# EAGLE design Tetris (EAGLE 6.5.0)
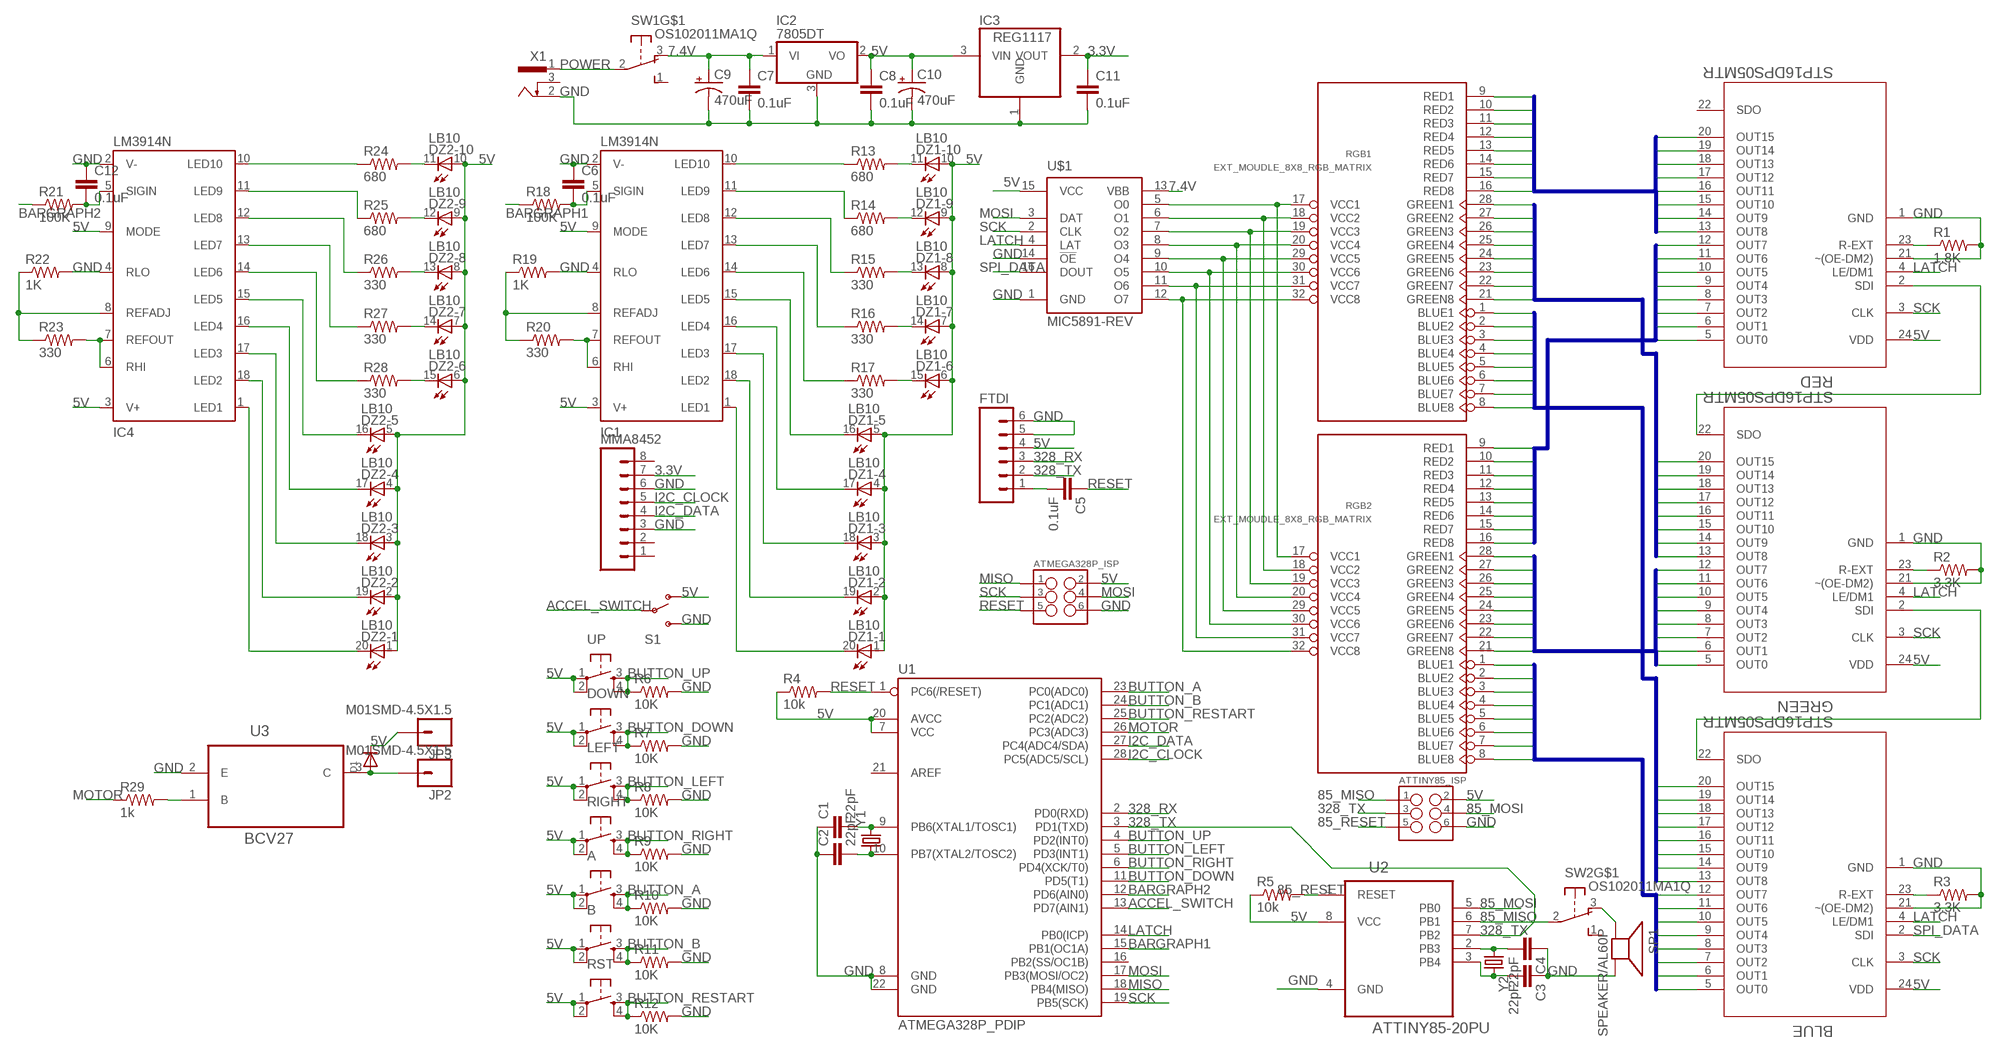
[diagram p0: schematic, sheet 1]

## Parts
A  TAC_SWITCHPTH  [TACTILE-PTH]
ATMEGA328P_ISP  M03X22X3_SILK_SM  [2X3]
ATTINY85_ISP  M03X22X3_SILK_SM  [2X3]
B  TAC_SWITCHPTH  [TACTILE-PTH]
BLUE  STP16DPS05MTR  [SOIC127P1032X265-24N]
C1  22pF  CAP0805  [0805]
C2  22pF  CAP0805  [0805]
C3  22pF  CAP0805  [0805]
C4  22pF  CAP0805  [0805]
C5  0.1uF  CAP0805  [0805]
C6  0.1uF  CAP0805  [0805]
C7  0.1uF  CAP0805  [0805]
C8  0.1uF  CAP0805  [0805]
C9  470uF  CAP_POLD  [PANASONIC_D]
C10  470uF  CAP_POLD  [PANASONIC_D]
C11  0.1uF  CAP0805  [0805]
C12  0.1uF  CAP0805  [0805]
D1  DIODESMA  [SMADIODE]
DOWN  TAC_SWITCHPTH  [TACTILE-PTH]
DZ1  LB10  [LB10]
DZ2  LB10  [LB10]
FTDI  M06LOCK  [1X06_LOCK]
GREEN  STP16DPS05MTR  [SOIC127P1032X265-24N]
IC1  LM3914N  [DIL18]
IC2  7805DT  [TO252]
IC3  REG1117  [SOT223]
IC4  LM3914N  [DIL18]
JP2  M01SMD-4.5X1.5  [PAD-1.5X4.5]
JP3  M01SMD-4.5X1.5  [PAD-1.5X4.5]
LEFT  TAC_SWITCHPTH  [TACTILE-PTH]
MMA8452  M08LOCK  [1X08_LOCK]
R1  1.8K  RESISTOR0805-RES  [0805]
R2  3.3K  RESISTOR0805-RES  [0805]
R3  3.3K  RESISTOR0805-RES  [0805]
R4  10k  RESISTOR0805-RES  [0805]
R5  10k  RESISTOR0805-RES  [0805]
R6  10K  RESISTOR0805-RES  [0805]
R7  10K  RESISTOR0805-RES  [0805]
R8  10K  RESISTOR0805-RES  [0805]
R9  10K  RESISTOR0805-RES  [0805]
R10  10K  RESISTOR0805-RES  [0805]
R11  10K  RESISTOR0805-RES  [0805]
R12  10K  RESISTOR0805-RES  [0805]
R13  680  RESISTOR0805-RES  [0805]
R14  680  RESISTOR0805-RES  [0805]
R15  330  RESISTOR0805-RES  [0805]
R16  330  RESISTOR0805-RES  [0805]
R17  330  RESISTOR0805-RES  [0805]
R18  100K  RESISTOR0805-RES  [0805]
R19  1K  RESISTOR0805-RES  [0805]
R20  330  RESISTOR0805-RES  [0805]
R21  100K  RESISTOR0805-RES  [0805]
R22  1K  RESISTOR0805-RES  [0805]
R23  330  RESISTOR0805-RES  [0805]
R24  680  RESISTOR0805-RES  [0805]
R25  680  RESISTOR0805-RES  [0805]
R26  330  RESISTOR0805-RES  [0805]
R27  330  RESISTOR0805-RES  [0805]
R28  330  RESISTOR0805-RES  [0805]
R29  1k  RESISTOR0805-RES  [0805]
RED  STP16DPS05MTR  [SOIC127P1032X265-24N]
RGB1  EXT_MOUDLE_8X8_RGB_MATRIX  [EXT_MOUDLE_8X8_RGB_MATRIX]
RGB2  EXT_MOUDLE_8X8_RGB_MATRIX  [EXT_MOUDLE_8X8_RGB_MATRIX]
RIGHT  TAC_SWITCHPTH  [TACTILE-PTH]
RST  TAC_SWITCHPTH  [TACTILE-PTH]
S1  SWITCH-SPDTPTH_LOCK  [SWITCH-SPDT_LOCK.007S]
SP1  SPEAKER/AL60P  [AL60P]
SW1  OS102011MA1Q  [OS102011MA1Q]
SW2  OS102011MA1Q  [OS102011MA1Q]
U1  ATMEGA328P_PDIP  [DIL28-3]
U2  ATTINY85-20PU  [DIP254P762X533-8]
U3  BCV27  [SOT95P230X93-3N]
U$1  MIC5891-REV  [DIL16]
UP  TAC_SWITCHPTH  [TACTILE-PTH]
X1  733989-5  [733989-5]
Y1  CRYSTALHC49US  [HC49US]
Y2  CRYSTALHC49US  [HC49US]

## Nets
3.3V: C11.1 IC3.2(VOUT) MMA8452.7
5V: A.1 A.2 ATMEGA328P_ISP.2 ATTINY85_ISP.2 B.1 B.2 BLUE.24(VDD) C8.1 C10.+ D1.C DOWN.1 DOWN.2 DZ1.1(-1:A) DZ1.2(-2:A) DZ1.3(-3:A) DZ1.4(-4:A) DZ1.5(-5:A) DZ1.6(-6:A) DZ1.7(-7:A) DZ1.8(-8:A) DZ1.9(-9:A) DZ1.10(-10:A) DZ2.1(-1:A) DZ2.2(-2:A) DZ2.3(-3:A) DZ2.4(-4:A) DZ2.5(-5:A) DZ2.6(-6:A) DZ2.7(-7:A) DZ2.8(-8:A) DZ2.9(-9:A) DZ2.10(-10:A) FTDI.4 GREEN.24(VDD) IC1.3(V+) IC1.9(MODE) IC2.2(VO) IC3.3(VIN) IC4.3(V+) IC4.9(MODE) JP3.P$1 LEFT.1 LEFT.2 R4.1 R5.1 RED.24(VDD) RIGHT.1 RIGHT.2 RST.1 RST.2 S1.1(O) U1.7(VCC) U1.20(AVCC) U2.8(VCC) U$1.15(VCC) UP.1 UP.2
7.4V: C7.1 C9.+ IC2.1(VI) SW1.3(O) U$1.13(VBB)
85_MISO: ATTINY85_ISP.1 SW2.2(P) U2.6(PB1)
85_MOSI: ATTINY85_ISP.4 U2.5(PB0)
85_RESET: ATTINY85_ISP.5 R5.2 U2.1(RESET)
328_RX: FTDI.3 U1.2(PD0(RXD))
328_TX: ATTINY85_ISP.3 FTDI.2 U1.3(PD1(TXD)) U2.7(PB2)
ACCEL_SWITCH: S1.2(P) U1.13(PD7(AIN1))
BARGRAPH1: R18.1 U1.15(PB1(OC1A))
BARGRAPH2: R21.1 U1.12(PD6(AIN0))
BLUE1: BLUE.20(OUT15) RGB1.8(BLUE8)
BLUE2: BLUE.19(OUT14) RGB1.7(BLUE7)
BLUE3: BLUE.18(OUT13) RGB1.6(BLUE6)
BLUE4: BLUE.17(OUT12) RGB1.5(BLUE5)
BLUE5: BLUE.16(OUT11) RGB1.4(BLUE4)
BLUE6: BLUE.15(OUT10) RGB1.3(BLUE3)
BLUE7: BLUE.14(OUT9) RGB1.2(BLUE2)
BLUE8: BLUE.13(OUT8) RGB1.1(BLUE1)
BLUE9: BLUE.12(OUT7) RGB2.8(BLUE8)
BLUE10: BLUE.11(OUT6) RGB2.7(BLUE7)
BLUE11: BLUE.10(OUT5) RGB2.6(BLUE6)
BLUE12: BLUE.9(OUT4) RGB2.5(BLUE5)
BLUE13: BLUE.8(OUT3) RGB2.4(BLUE4)
BLUE14: BLUE.7(OUT2) RGB2.3(BLUE3)
BLUE15: BLUE.6(OUT1) RGB2.2(BLUE2)
BLUE16: BLUE.5(OUT0) RGB2.1(BLUE1)
BUTTON_A: A.3 A.4 R10.1 U1.23(PC0(ADC0))
BUTTON_B: B.3 B.4 R11.1 U1.24(PC1(ADC1))
BUTTON_DOWN: DOWN.3 DOWN.4 R7.1 U1.11(PD5(T1))
BUTTON_LEFT: LEFT.3 LEFT.4 R8.1 U1.5(PD3(INT1))
BUTTON_RESTART: R12.1 RST.3 RST.4 U1.25(PC2(ADC2))
BUTTON_RIGHT: R9.1 RIGHT.3 RIGHT.4 U1.6(PD4(XCK/T0))
BUTTON_UP: R6.1 U1.4(PD2(INT0)) UP.3 UP.4
GND: ATMEGA328P_ISP.6 ATTINY85_ISP.6 BLUE.1(GND) BLUE.21(~(OE-DM2)) C1.1 C2.1 C3.1 C4.1 C6.1 C7.2 C8.2 C9.- C10.- C11.2 C12.1 FTDI.5 FTDI.6 GREEN.1(GND) GREEN.21(~(OE-DM2)) IC1.2(V-) IC1.4(RLO) IC2.3(GND) IC3.1(GND) IC4.2(V-) IC4.4(RLO) MMA8452.3 MMA8452.6 R1.2 R2.2 R3.2 R6.2 R7.2 R8.2 R9.2 R10.2 R11.2 R12.2 R19.2 R22.2 RED.1(GND) RED.21(~(OE-DM2)) S1.3(S) SP1.2(-) U1.8(GND) U1.22(GND) U2.4(GND) U3.2(E) U$1.1(GND) U$1.14(!OE) X1.2
GREEN1: GREEN.20(OUT15) RGB1.21(GREEN8)
GREEN2: GREEN.19(OUT14) RGB1.22(GREEN7)
GREEN3: GREEN.18(OUT13) RGB1.23(GREEN6)
GREEN4: GREEN.17(OUT12) RGB1.24(GREEN5)
GREEN5: GREEN.16(OUT11) RGB1.25(GREEN4)
GREEN6: GREEN.15(OUT10) RGB1.26(GREEN3)
GREEN7: GREEN.14(OUT9) RGB1.27(GREEN2)
GREEN8: GREEN.13(OUT8) RGB1.28(GREEN1)
GREEN9: GREEN.12(OUT7) RGB2.21(GREEN8)
GREEN10: GREEN.11(OUT6) RGB2.22(GREEN7)
GREEN11: GREEN.10(OUT5) RGB2.23(GREEN6)
GREEN12: GREEN.9(OUT4) RGB2.24(GREEN5)
GREEN13: GREEN.8(OUT3) RGB2.25(GREEN4)
GREEN14: GREEN.7(OUT2) RGB2.26(GREEN3)
GREEN15: GREEN.6(OUT1) RGB2.27(GREEN2)
GREEN16: GREEN.5(OUT0) RGB2.28(GREEN1)
I2C_CLOCK: MMA8452.5 U1.28(PC5(ADC5/SCL))
I2C_DATA: MMA8452.4 U1.27(PC4(ADC4/SDA))
LATCH: BLUE.4(LE/DM1) GREEN.4(LE/DM1) RED.4(LE/DM1) U1.14(PB0(ICP)) U$1.4(LAT)
MISO: ATMEGA328P_ISP.1 U1.18(PB4(MISO))
MOSI: ATMEGA328P_ISP.4 U1.17(PB3(MOSI/OC2)) U$1.3(DAT)
MOTOR: R29.1 U1.26(PC3(ADC3))
N$1: R1.1 RED.23(R-EXT)
N$2: RGB1.18(VCC2) RGB2.18(VCC2) U$1.6(O1)
N$3: RGB1.19(VCC3) RGB2.19(VCC3) U$1.7(O2)
N$4: RGB1.20(VCC4) RGB2.20(VCC4) U$1.8(O3)
N$5: RGB1.29(VCC5) RGB2.29(VCC5) U$1.9(O4)
N$6: RGB1.30(VCC6) RGB2.30(VCC6) U$1.10(O5)
N$7: RGB1.31(VCC7) RGB2.31(VCC7) U$1.11(O6)
N$8: RGB1.32(VCC8) RGB2.32(VCC8) U$1.12(O7)
N$9: C5.2 FTDI.1
N$10: DZ1.15(-6:C) R17.2
N$11: C1.2 U1.9(PB6(XTAL1/TOSC1)) Y1.2
N$12: C2.2 U1.10(PB7(XTAL2/TOSC2)) Y1.1
N$13: C3.2 U2.3(PB4) Y2.2
N$14: C4.2 U2.2(PB3) Y2.1
N$15: DZ1.14(-7:C) R16.2
N$16: DZ1.13(-8:C) R15.2
N$17: GREEN.22(SDO) RED.2(SDI)
N$18: GREEN.23(R-EXT) R2.1
N$19: RGB1.17(VCC1) RGB2.17(VCC1) U$1.5(O0)
N$20: DZ1.12(-9:C) R14.2
N$21: DZ1.11(-10:C) R13.2
N$22: BLUE.22(SDO) GREEN.2(SDI)
N$23: IC1.10(LED10) R13.1
N$24: BLUE.23(R-EXT) R3.1
N$25: IC1.11(LED9) R14.1
N$26: IC1.12(LED8) R15.1
N$27: IC1.13(LED7) R16.1
N$28: IC1.14(LED6) R17.1
N$29: DZ1.16(-5:C) IC1.15(LED5)
N$30: DZ1.17(-4:C) IC1.16(LED4)
N$31: DZ1.18(-3:C) IC1.17(LED3)
N$32: DZ1.19(-2:C) IC1.18(LED2)
N$33: DZ1.20(-1:C) IC1.1(LED1)
N$34: C6.2 IC1.5(SIGIN) R18.2
N$35: IC1.8(REFADJ) R19.1 R20.1
N$36: IC1.6(RHI) IC1.7(REFOUT) R20.2
N$37: IC4.11(LED9) R25.1
N$38: IC4.12(LED8) R26.1
N$39: IC4.13(LED7) R27.1
N$40: IC4.14(LED6) R28.1
N$41: DZ2.16(-5:C) IC4.15(LED5)
N$42: DZ2.17(-4:C) IC4.16(LED4)
N$43: DZ2.18(-3:C) IC4.17(LED3)
N$44: DZ2.19(-2:C) IC4.18(LED2)
N$45: DZ2.20(-1:C) IC4.1(LED1)
N$46: C12.2 IC4.5(SIGIN) R21.2
N$47: IC4.8(REFADJ) R22.1 R23.1
N$48: IC4.6(RHI) IC4.7(REFOUT) R23.2
N$49: IC4.10(LED10) R24.1
N$50: DZ2.15(-6:C) R28.2
N$51: DZ2.14(-7:C) R27.2
N$52: DZ2.13(-8:C) R26.2
N$53: DZ2.12(-9:C) R25.2
N$54: DZ2.11(-10:C) R24.2
N$55: R29.2 U3.1(B)
N$56: D1.A JP2.P$1 U3.3(C)
N$58: SP1.1(+) SW2.3(O)
POWER: SW1.2(P) X1.1
RED1: RED.20(OUT15) RGB1.16(RED8)
RED2: RED.19(OUT14) RGB1.15(RED7)
RED3: RED.18(OUT13) RGB1.14(RED6)
RED4: RED.17(OUT12) RGB1.13(RED5)
RED5: RED.16(OUT11) RGB1.12(RED4)
RED6: RED.15(OUT10) RGB1.11(RED3)
RED7: RED.14(OUT9) RGB1.10(RED2)
RED8: RED.13(OUT8) RGB1.9(RED1)
RED9: RED.12(OUT7) RGB2.16(RED8)
RED10: RED.11(OUT6) RGB2.15(RED7)
RED11: RED.10(OUT5) RGB2.14(RED6)
RED12: RED.9(OUT4) RGB2.13(RED5)
RED13: RED.8(OUT3) RGB2.12(RED4)
RED14: RED.7(OUT2) RGB2.11(RED3)
RED15: RED.6(OUT1) RGB2.10(RED2)
RED16: RED.5(OUT0) RGB2.9(RED1)
RESET: ATMEGA328P_ISP.5 C5.1 R4.2 U1.1(PC6(/RESET))
SCK: ATMEGA328P_ISP.3 BLUE.3(CLK) GREEN.3(CLK) RED.3(CLK) U1.19(PB5(SCK)) U$1.2(CLK)
SPI_DATA: BLUE.2(SDI) U$1.16(DOUT)
Unconnected: MMA8452.1 MMA8452.2 MMA8452.8 RED.22(SDO) SW1.1(S) SW1.MT1(MT) SW1.MT2(MT) SW2.1(S) SW2.MT1(MT) SW2.MT2(MT) U1.16(PB2(SS/OC1B)) U1.21(AREF) X1.3

## Buses
RED[1..8]
GREEN[1..8]
BLUE[1..8]
RED[9..16]
GREEN[9..16]
BLUE[9..16]

## Library data of the parts
A B DOWN LEFT RIGHT RST UP = SparkFun-Electromechanical:TAC_SWITCH: Momentary Switch Button commonly used for reset or general input. Spark Fun Electronics SKU : COM-00097 SMT- SWCH-08247
ATMEGA328P_ISP ATTINY85_ISP = SparkFun-Connectors:M03X2: 2x3 .1" header. Shrouded, with keying- CONN-10681 SMT- CONN-11415 Pogo pins- HW-11044
BLUE GREEN RED = ST Microelctronics_By_element14_Batch_1:STP16DPS05MTR: LED sink driver; MPN: STP16DPS05MTR; OC_FARNELL: -; OC_NEWARK: 71R7069; PACKAGE: SOIC-24; SUPPLIER: STMICROELECTRONICS
C1-C8 C11 C12 = SparkFun-Capacitors:CAP: Capacitor Standard 0603 ceramic capacitor, and 0.1" leaded capacitor.
C9 C10 = SparkFun-Capacitors:CAP_POL: Capacitor Polarized These are standard SMD and PTH capacitors. Normally 10uF, 47uF, and 100uF in electrolytic and tantalum varieties. Always verify the external diameter of the through hole cap, it varies with capacity, voltage, and manufacturer. The EIA devices should be standard.
D1 = adafruit:DIODE: Diode SMADIODE - SMA Surface Mount Package 20V 1A Schottky Diode Digikey: 641-1014-6-ND DO-1N4148 - Through Hole Small Current Diode SOD-123 20V 1 A (.5mV Vf) Schottky Diode - Digikey: MBRX120TPMSCT-ND SOD-323 10V 570mA (.38mV Vf, 3ns) Schottky Diode - Digikey: ZLLS410CT-ND SOD-523 30V 30mA Schottky Diode (RB751S-40TE61) - Digikey: RB751S-40TE61CT-ND SOT23-R/W - SOT23 Package (R = Solder Paste/Reflow Ovens, W = Hand-Soldering) BAT54Film 40V 300mA - Digikey: 497-7162-1-ND
DZ1 DZ2 = led:LB10: LED BLOCK 10-LED bar graph, DIL, Siemens
FTDI = SparkFun-Connectors:M06: Header 6 Standard 6-pin 0.1" header. Use with straight break away headers (SKU : PRT-00116), right angle break away headers (PRT-00553), swiss pins (PRT-00743), machine pins (PRT-00117), and female headers (PRT-00115). Molex polarized connector foot print use with SKU : PRT-08094 with associated crimp pins and housings. NOTES ON THE VARIANTS LOCK and LOCK_LONGPADS... This footprint was designed to help hold the alignment of a through-hole component (i.e. 6-pin header) while soldering it into place. You may notice that each hole has been shifted either up or down by 0.005 of an inch from it's more standard position (which is a perfectly straight line). This slight alteration caused the pins (the squares in the middle) to touch the edges of the holes. Because they are alternating, it causes a "brace" to hold the component in place. 0.005 has proven to be the perfect amount of "off-center" position when using our standard breakaway headers. Although looks a little odd when you look at the bare footprint, once you have a header in there, the alteration is very hard to notice. Also,if you push a header all the way into place, it is covered up entirely on the bottom side. This idea of altering the position of holes to aid alignment will be further integrated into the Sparkfun Library for other footprints. It can help hold any component with 3 or more connection pins.
IC1 IC4 = national-semiconductor:LM391: Dot/Bar Display Driver Source: Data sheet LM3915 <http://www.national.com/ds/LM/LM3915.pdf> Data sheet LM3914 <http://www.national.com/ds/LM/LM3914.pdf>
IC2 = adafruit:78*: Positive VOLTAGE REGULATOR Added bigger pads to the TO-92 package
IC3 = burr-brown:REG1117: 800mA and 1A Low Dropout (LDO) Positive Regulator 1.8V, 2.5V, 2.85V, 3.3V, 5V, and Adj; MPN: REG1117; OC_FARNELL: 1097566; OC_NEWARK: 14P6981
JP2 JP3 = SparkFun-Connectors:M01: Header 1 Standard 1-pin 0.1" header. Use with straight break away headers (SKU : PRT-00116), right angle break away headers (PRT-00553), swiss pins (PRT-00743), machine pins (PRT-00117), and female headers (PRT-00115).
MMA8452 = SparkFun-Connectors:M08: Header 8 Standard 8-pin 0.1" header. Use with straight break away headers (SKU : PRT-00116), right angle break away headers (PRT-00553), swiss pins (PRT-00743), machine pins (PRT-00117), and female headers (PRT-00115).
R1-R29 = SparkFun-Passives:RESISTOR: Resistor Basic schematic elements and footprints for 0603, 1206, and PTH resistors.
RGB1 RGB2 = Rainbowduino V3.0b:EXT_MOUDLE_8X8_RGB_MATRIX
S1 = SparkFun-Electromechanical:SWITCH-SPDT: SPDT Switch Simple slide switch, Spark Fun Electronics SKU : COM-00102 DPDT SMT slide switch, AYZ0202, SWCH-08179
SP1 = adafruit:SPEAKER: SPEAKER Source: Buerklin Added PS12 (for part # PS1240 piezo) http://www.ladyada.net/library/pcb/eaglelibrary.html
SW1 SW2 = adafruit:OS102011MA1Q: OS10201MA1Q through-hole right angle switch http://www.ladyada.net/library/eagle
U1 = SparkFun-DigitalIC:ATMEGA328P_PDIP: uC used in the Arduino 32kb flash, 1k EEPROM, 2k SRAM This is the through-hole version of this chip.
U2 = Atmel_By_element14_Batch_1:ATTINY85-20PU: 8-bit Microcontroller with In-System Programmable Flash; MPN: ATTINY85-20PU; OC_FARNELL: 1455162; OC_NEWARK: 58M3796; PACKAGE: PDIP-8; SUPPLIER: Atmel
U3 = Fairchild_By_element14_Batch_1:BCV27: NPN Darlington Transistor; MPN: BCV27; OC_FARNELL: 9846689; OC_NEWARK: 58K8749; PACKAGE: SOT-3; SUPPLIER: Fairchild
U$1 = Edeca.net:MIC5891-REV: 8-Bit Serial-Input Latched Source Driver (output pin order reversed in symbol, for easier use on schematics)
X1 = 3.5mm-DC-Jack:73398?: FEMALE PRINT CONNECTOR Niedervolt-Steckverbinder Distributor Conrad
Y1 Y2 = SparkFun-FreqCtrl:CRYSTAL: Various standard crystals. Proven footprints. Spark Fun Electronics SKU : COM-00534

## Board
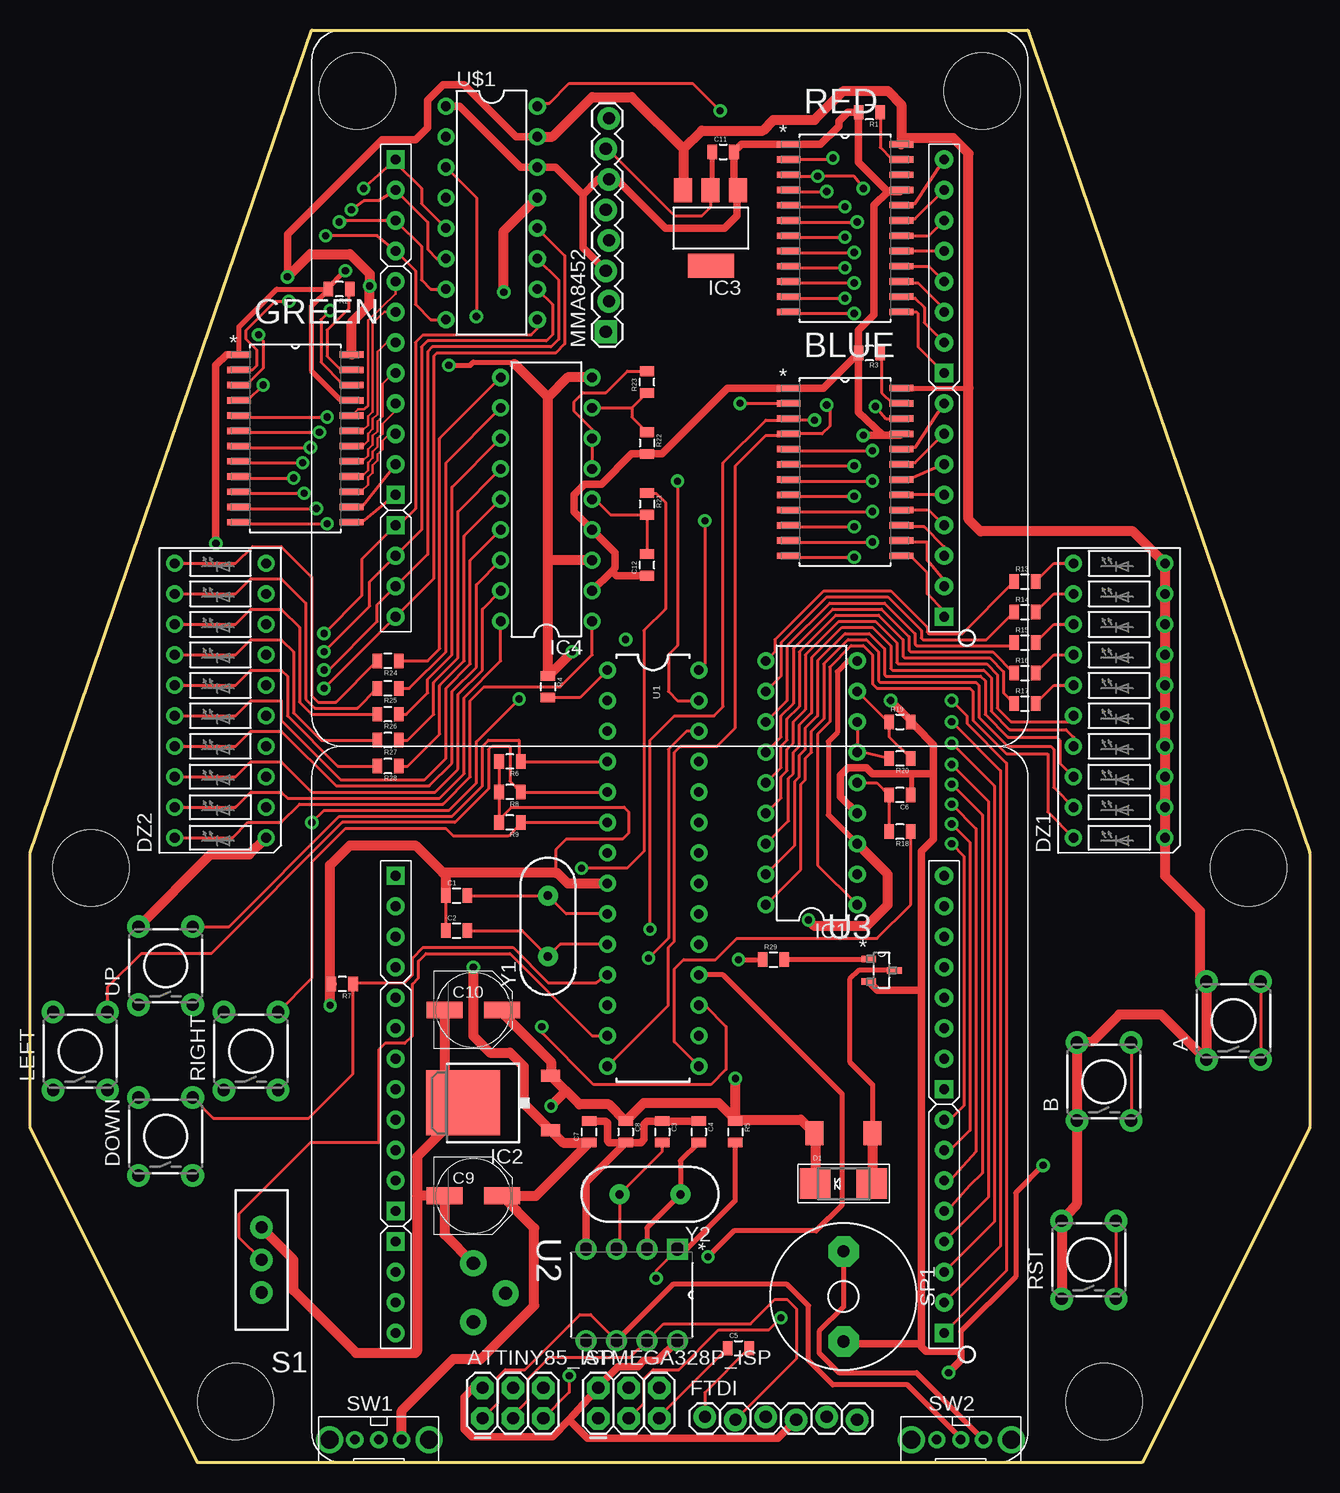
[diagram p1: board, top side]
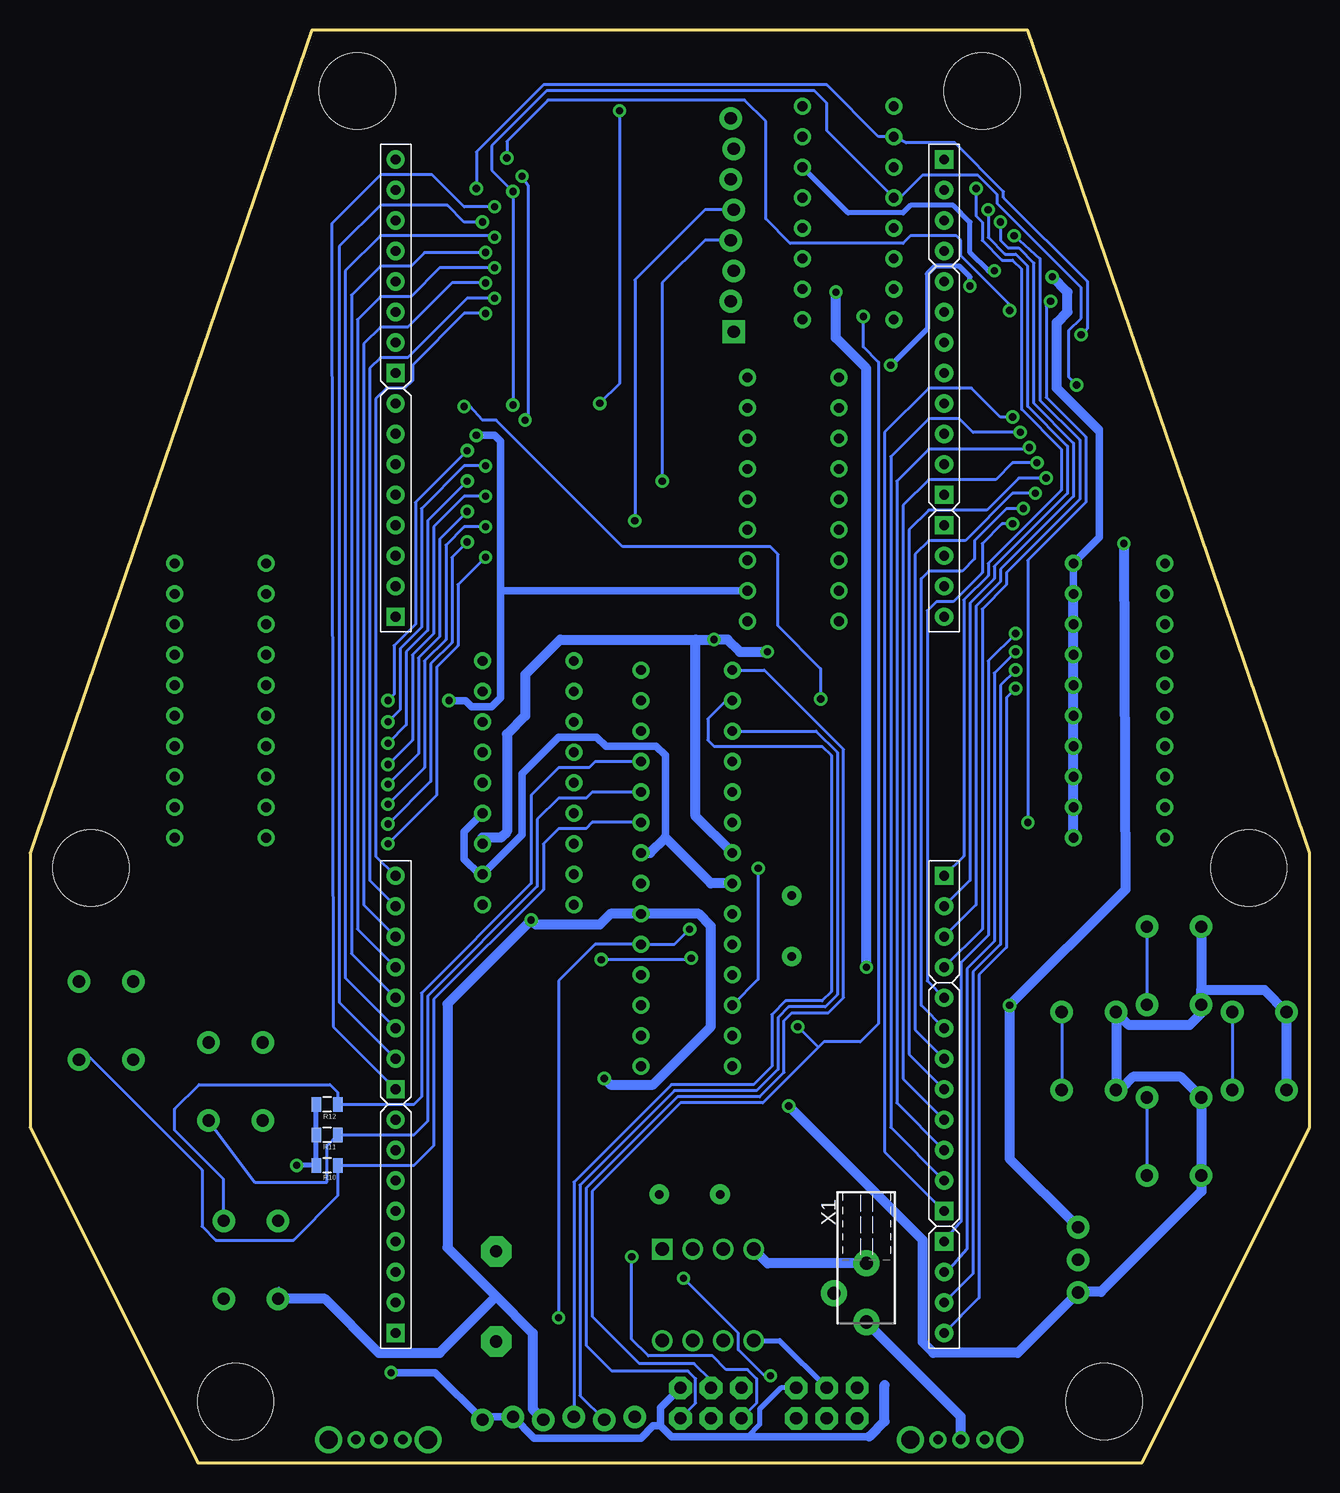
[diagram p2: board, bottom side, seen from below]

Size 106.68 x 119.38 mm. Coordinates in mm from the lower left corner, seen from the top.
Outline: 83.19,119.38 106.68,50.8 106.68,27.94 92.71,0 13.97,0 0,27.94 0,50.8 23.5,119.38 83.19,119.38
Copper layers (1*16): Top 0.035mm / dielectric 1.5mm / Bottom 0.035mm
Design rules "SparkFun": minimum track width 8mil, minimum drill 20mil, track to track 8mil, track to pad 8mil, pad to pad 8mil, via to via 8mil, smd to smd 8mil, copper to edge 10mil, drill to drill 8mil, minimum pad ring 12mil, minimum via ring 10mil, stop-mask expansion 4mil, vias tented up to drill 25mil, thermal gap 10mil
Holes 6.35 mm at 27.3,114.3 5.08,49.53 101.6,49.53 17.14,5.08 89.53,5.08 79.38,114.3

### Footprints (pad centres in the part's own frame; a part is rotated, then mirrored left to right if it is on the bottom)
TACTILE-PTH = drill 1.016 pad 1.88: 1 -3.251,2.261; 2 3.251,2.261; 3 -3.251,-2.261; 4 3.251,-2.261
2X3 = drill 1.016 pad 1.88 octagon: 1 0,0; 2 0,2.54; 3 2.54,0; 4 2.54,2.54; 5 5.08,0; 6 5.08,2.54
SOIC127P1032X265-24N = smd 1.981 x 0.533: 1 -4.699,6.985; 2 -4.699,5.715; 3 -4.699,4.445; 4 -4.699,3.175; 5 -4.699,1.905; 6 -4.699,0.635; 7 -4.699,-0.635; 8 -4.699,-1.905; 9 -4.699,-3.175; 10 -4.699,-4.445; 11 -4.699,-5.715; 12 -4.699,-6.985; 13 4.699,-6.985; 14 4.699,-5.715; 15 4.699,-4.445; 16 4.699,-3.175; 17 4.699,-1.905; 18 4.699,-0.635; 19 4.699,0.635; 20 4.699,1.905; 21 4.699,3.175; 22 4.699,4.445; 23 4.699,5.715; 24 4.699,6.985
0805 = smd 0.8 x 1.2: 1 -0.9,0; 2 0.9,0
PANASONIC_D = smd 3 x 1.4: + 2.4,0; - -2.4,0
SMADIODE = smd 2.54 x 2.54: A 2.349,0; C -2.349,0
LB10 = drill 0.813: 1 -11.43,-3.81; 2 -8.89,-3.81; 3 -6.35,-3.81; 4 -3.81,-3.81; 5 -1.27,-3.81; 6 1.27,-3.81; 7 3.81,-3.81; 8 6.35,-3.81; 9 8.89,-3.81; 10 11.43,-3.81; 11 11.43,3.81; 12 8.89,3.81; 13 6.35,3.81; 14 3.81,3.81; 15 1.27,3.81; 16 -1.27,3.81; 17 -3.81,3.81; 18 -6.35,3.81; 19 -8.89,3.81; 20 -11.43,3.81
1X06_LOCK = drill 1.016 pad 1.88: 1 0,0; 2 2.54,-0.254; 3 5.08,0; 4 7.62,-0.254; 5 10.16,0; 6 12.7,-0.254
DIL18 = drill 0.813: 1 -10.16,-3.81; 2 -7.62,-3.81; 3 -5.08,-3.81; 4 -2.54,-3.81; 5 0,-3.81; 6 2.54,-3.81; 7 5.08,-3.81; 8 7.62,-3.81; 9 10.16,-3.81; 10 10.16,3.81; 11 7.62,3.81; 12 5.08,3.81; 13 2.54,3.81; 14 0,3.81; 15 -2.54,3.81; 16 -5.08,3.81; 17 -7.62,3.81; 18 -10.16,3.81
TO252 = smd 1 x 1.6: 1 -2.28,-4.8; 2 2.28,-4.8 | smd 5.4 x 6.2: 3 0,2.5
SOT223 = smd 1.499 x 2.007: 1 -2.261,-3.15; 2 0.025,-3.15; 3 2.311,-3.15 | smd 3.81 x 2.007: 4 0,3.15
PAD-1.5X4.5 = smd 1.5 x 2: P$1 0,0
1X08_LOCK = drill 1.016 pad 1.88 square: 1 0,0.127 | drill 1.016 pad 1.88: 2 2.54,-0.127; 3 5.08,0.127; 4 7.62,-0.127; 5 10.16,0.127; 6 12.7,-0.127; 7 15.24,0.127; 8 17.78,-0.127
EXT_MOUDLE_8X8_RGB_MATRIX = drill 0.813 pad 1.524 square: 1 6.985,48.895; 9 6.985,28.575; 17 52.705,10.795; 28 52.705,38.735; 29 52.705,41.275 | drill 0.813 pad 1.524: 2 6.985,46.355; 3 6.985,43.815; 4 6.985,41.275; 5 6.985,38.735; 6 6.985,36.195; 7 6.985,33.655; 8 6.985,31.115; 10 6.985,26.035; 11 6.985,23.495; 12 6.985,20.955; 13 6.985,18.415; 14 6.985,15.875; 15 6.985,13.335; 16 6.985,10.795; 18 52.705,13.335; 19 52.705,15.875; 20 52.705,18.415; 21 52.705,20.955; 22 52.705,23.495; 23 52.705,26.035; 24 52.705,28.575; 25 52.705,31.115; 26 52.705,33.655; 27 52.705,36.195; 30 52.705,43.815; 31 52.705,46.355; 32 52.705,48.895
SWITCH-SPDT_LOCK.007S = drill 1.016 pad 1.88: 1 0,2.718; 2 0,0; 3 0,-2.718
AL60P = drill 1.016 pad 2.54 octagon: 1 -3.759,0; 2 3.759,0
OS102011MA1Q = drill 0.8 pad 1.422: 1 -2,0; 2 0,0; 3 1.9,0 | drill 1.5 pad 2.184: MT1 -4.1,0; MT2 4.2,0
DIL28-3 = drill 0.813: 1 -16.51,-3.81; 2 -13.97,-3.81; 3 -11.43,-3.81; 4 -8.89,-3.81; 5 -6.35,-3.81; 6 -3.81,-3.81; 7 -1.27,-3.81; 8 1.27,-3.81; 9 3.81,-3.81; 10 6.35,-3.81; 11 8.89,-3.81; 12 11.43,-3.81; 13 13.97,-3.81; 14 16.51,-3.81; 15 16.51,3.81; 16 13.97,3.81; 17 11.43,3.81; 18 8.89,3.81; 19 6.35,3.81; 20 3.81,3.81; 21 1.27,3.81; 22 -1.27,3.81; 23 -3.81,3.81; 24 -6.35,3.81; 25 -8.89,3.81; 26 -11.43,3.81; 27 -13.97,3.81; 28 -16.51,3.81
DIP254P762X533-8 = drill 1.118 square: 1 -7.62,7.62 | drill 1.118: 2 -7.62,5.08; 3 -7.62,2.54; 4 -7.62,0; 5 0,0; 6 0,2.54; 7 0,5.08; 8 0,7.62
SOT95P230X93-3N = smd 1.219 x 0.533: 1 -1.067,0.94; 2 -1.067,-0.94; 3 1.067,0
DIL16 = drill 0.813: 1 -8.89,-3.81; 2 -6.35,-3.81; 3 -3.81,-3.81; 4 -1.27,-3.81; 5 1.27,-3.81; 6 3.81,-3.81; 7 6.35,-3.81; 8 8.89,-3.81; 9 8.89,3.81; 10 6.35,3.81; 11 3.81,3.81; 12 1.27,3.81; 13 -1.27,3.81; 14 -3.81,3.81; 15 -6.35,3.81; 16 -8.89,3.81
733989-5 = drill 1.1 pad 2.184: 1 0,5.82; 2 0,0.92; 3 2.7,3.42
HC49US = drill 0.7 pad 1.651: 1 -2.54,0; 2 2.54,0

### Placement (x,y rotation side)
A  100.33,36.83 90 top
ATMEGA328P_ISP  47.37,3.68 0 top
ATTINY85_ISP  37.72,3.68 0 top
B  89.53,31.75 90 top
BLUE  67.94,82.55 0 top
C1  35.56,47.24 0 top
C2  35.56,44.32 0 top
C3  52.7,27.56 270 top
C4  55.75,27.56 270 top
C5  59.05,9.53 0 top
C6  72.52,55.63 180 top
C7  46.61,27.56 90 top
C8  49.66,27.56 270 top
C9  36.96,22.23 0 top
C10  36.96,37.72 0 top
C11  57.78,109.22 0 top
C12  51.44,74.8 90 top
D1  67.82,23.24 0 top
DOWN  11.3,27.18 90 top
DZ1  90.81,63.5 90 top
DZ2  15.88,63.5 90 top
FTDI  56.26,3.81 0 top
GREEN  22.12,85.34 0 top
IC1  65.15,56.64 90 top
IC2  38.61,29.97 90 top
IC3  56.77,102.87 180 top
IC4  43.05,80.26 90 top
JP2  70.23,27.43 0 top
JP3  65.41,27.43 0 top
LEFT  4.19,34.29 90 top
MMA8452  48.13,94.23 90 top
R1  69.98,112.52 180 top
R2  25.78,97.79 180 top
R3  69.98,92.46 180 top
R4  43.18,64.64 270 top
R5  58.8,27.56 270 top
R6  40.01,58.42 180 top
R7  26.04,39.88 180 top
R8  40.01,55.88 180 top
R9  40.01,53.34 180 top
R10  81.92,24.77 180 bottom
R11  81.92,27.3 180 bottom
R12  81.92,29.84 180 bottom
R13  82.93,73.41 0 top
R14  82.93,70.87 0 top
R15  82.93,68.33 0 top
R16  82.93,65.79 0 top
R17  82.93,63.25 0 top
R18  72.52,52.58 180 top
R19  72.52,61.72 0 top
R20  72.52,58.67 180 top
R21  51.44,79.88 270 top
R22  51.44,84.96 270 top
R23  51.44,90.04 90 top
R24  29.84,66.8 180 top
R25  29.84,64.52 180 top
R26  29.84,62.36 180 top
R27  29.84,60.2 180 top
R28  29.84,58.04 180 top
R29  61.98,41.91 0 top
RED  67.94,102.87 0 top
RGB1  83.19,119.38 180 top
RGB2  83.19,59.69 180 top
RIGHT  18.41,34.29 90 top
RST  88.27,16.89 90 top
S1  19.3,16.89 180 top
SP1  67.82,13.84 270 top
SW1  29.08,1.91 0 top
SW2  77.6,1.91 0 top
U1  51.94,49.53 270 top
U2  46.35,10.16 270 top
U3  70.99,41.02 0 top
U$1  38.48,104.14 270 top
UP  11.3,41.4 90 top
X1  36.96,17.53 180 bottom
Y1  43.18,44.7 90 top
Y2  51.69,22.35 180 top

### Tracks (layer width: path | path; a pad name or v marks a point on that pad's centre or on a via)
3.3V
  Top 0.254: 56.88,106.16 IC3.2 56.77,105.99 56.77,104.65 56.01,103.89 53.72,103.89 48.13,109.47 MMA8452.7
  Top 0.406: 56.88,106.16 C11.1
5V  (via drill 0.6)
  Top 0.254: RED.24 72.77,109.98 | 85.95,14.48 RST.1 | 54.48,106.05 IC3.3
  Top 0.406: IC1.9 68.2,66.8 67.31,65.91 67.31,60.83 66.55,60.07 66.55,53.98 IC1.3 | v34.92,91.44 36.7,91.44 36.96,91.69 40.26,91.69 | BLUE.24 78.23,89.53
  Top 0.61: U$1.15 40.51,110.49 36.2,114.81 34.42,114.81 33.15,113.54 33.15,111.25 32.13,110.24 29.34,110.24 21.46,102.36 v21.46,98.81 | ATTINY85_ISP.2 36.96,6.22 36.2,5.46 36.2,2.79 36.83,2.16 43.56,2.16 44.96,3.56 | 44.96,3.56 ATMEGA328P_ISP.2 47.62,6.48 47.62,6.6 49.02,8 50.67,8 51.18,8.51 52.32,8.51 U2.8 | 44.96,3.56 46.48,2.03 62.36,2.03 FTDI.4
  Top 0.813: v21.46,98.81 23.37,100.71 26.67,100.71 28.32,99.06 v28.32,98.04 28.32,96.52 26.82,95.02 GREEN.24 | RST.1 RST.2 87.12,21.34 87.27,21.61 B.1 B.2 88.54,35.08 90.81,37.34 94.31,37.34 A.1 A.2 97.54,40.18 97.54,45.97 94.61,48.9 DZ1.1 DZ1.2 DZ1.3 DZ1.4 DZ1.5 DZ1.6 DZ1.7 DZ1.8 DZ1.9 DZ1.10 91.95,77.6 79.25,77.6 78.23,78.61 78.23,89.53 78.23,109.09 76.96,110.36 73.15,110.36 RED.24 72.64,113.16 71.5,114.3 67.82,114.3 65.41,111.89 61.98,111.89 61.09,111 56.01,111 54.48,109.47 | IC1.3 71.5,49.02 71.5,46.48 69.72,44.7 65.41,44.7 v64.9,45.21 | 58.8,28.57 57.4,29.97 51.17,29.97 C8.1 48.26,29.86 45.8,29.86 IC2.2 43.43,32.28 43.43,33.4 39.36,37.48 C10.+ | R5.1 58.8,28.57 | 58.8,28.57 v58.8,32 | U$1.15 43.56,110.49 46.86,113.79 50.16,113.79 54.48,109.47 | 54.48,109.47 54.48,106.05 | UP.2 15.06,50.67 18.29,50.67 DZ2.1 | 58.8,28.57 64.26,28.57 JP3.P$1 65.47,27.37 D1.C | v45.21,67.56 43.19,65.54 R4.1 | R4.1 43.18,75.18 | 43.18,75.18 43.18,88.77 | 43.18,88.77 40.39,91.57 | IC4.9 44.83,90.42 43.18,88.77 | IC4.3 43.18,75.18 | R4.1 | v43.43,29.72 44.58,30.86
  Bottom 0.254: 85.93,14.53 RST.1 86,14.5
  Bottom 0.406: v28.32,98.04 28.32,98.81 29.21,99.69 31.24,99.69 31.88,99.06 31.88,94.49 v34.92,91.44
  Bottom 0.61: 16.13,31.11 15.75,31.11 15.82,31.04 | 17.65,86.11 17.53,85.98 17.53,77.09 DZ2.10 DZ2.9
  Bottom 0.813: 17.65,86.11 21.08,89.53 21.08,95 20.19,95.89 20.19,97.54 v21.46,98.81 | IC1.3 68.96,52.07 67.44,52.07 66.93,52.58 66.93,60.71 65.41,62.23 65.41,65.66 62.48,68.58 51.18,68.58 | v58.8,32 58.29,31.5 54.74,31.5 49.91,36.32 49.91,44.7 50.93,45.72 U1.20 58.29,45.72 59.18,44.83 64.52,44.83 v64.9,45.21 71.88,38.23 71.88,17.91 67.82,13.84 | 9.04,39.37 3.76,39.37 LEFT.2 LEFT.1 | 16.13,31.11 16.13,37.52 RIGHT.2 15.06,36.45 10.03,36.45 9.04,37.44 UP.1 9.04,39.37 | 15.75,31.11 14.73,32.13 10.74,32.13 DOWN.2 DOWN.1 9.02,23.9 9.02,22.61 17.4,14.22 19.3,14.22 S1.1 24.33,9.14 31.37,9.14 32.26,10.03 32.26,18.54 v43.43,29.72 | RIGHT.1 15.82,31.04 | UP.2 9.04,39.37 | DZ2.1 DZ2.2 DZ2.3 DZ2.4 DZ2.5 DZ2.6 DZ2.7 DZ2.8 DZ2.9 | 51.18,68.58 v49.66,68.58 48.51,68.58 47.5,67.56 v45.21,67.56 | U1.7 51.18,53.85 51.18,68.58 | RST.1 82.09,13.64 77.6,9.14 72.52,9.14 67.82,13.84 | 67.82,13.84 64.77,10.79 64.77,4.45 FTDI.4
7.4V  (via drill 0.6)
  Top 0.813: v39.5,97.54 39.5,102.62 U$1.13 | SW1.3 30.98,4.31 35.31,8.64 37.59,8.64 42.04,13.08 42.04,19.55 C9.+ 42.17,22.23 C7.1 44.44,26.66 IC2.1 41.15,29.95 41.15,33.02 40.01,34.16 38.35,34.16 36.96,35.56 v36.96,41.27
  Bottom 0.813: v36.96,41.27 36.96,91.19 39.5,93.73 v39.5,97.54
85_MISO
  Top 0.254: ATTINY85_ISP.1 38.99,4.95 38.99,7.11 39.62,7.75 41.27,7.75 45.85,12.32 46.74,12.32 U2.6
  Top 0.406: SW2.2 77.6,2.03 73.15,6.48 66.93,6.48 64.9,8.51 64.9,13.08 63.12,14.86 53.59,14.86 U2.6
85_MOSI
  Bottom 0.406: U2.5 44.2,10.16 ATTINY85_ISP.4
85_RESET  (via drill 0.6)
  Top 0.254: ATTINY85_ISP.5 44.96,5.84 v44.96,7.24 | U2.1 52.2,16 v52.2,15.37
  Top 0.406: R5.2 58.8,21.84 54.74,17.78 U2.1
  Bottom 0.254: v44.96,7.24 45.47,7.24 47.62,9.4 47.62,10.79 v52.2,15.37
328_RX
  Bottom 0.254: U1.2 48.64,63.5 50.16,61.98 50.16,60.2 49.66,59.69 40.64,59.69 39.88,58.93 39.88,39.24 40.64,38.48 43.69,38.48 44.83,37.34 44.83,33.02 46.35,31.5 53.21,31.5 61.34,23.37 FTDI.3
328_TX
  Top 0.254: ATTINY85_ISP.3 40.26,3.94 41.53,5.21 41.53,6.99 43.31,8.76 50.04,8.76 U2.7 52.83,11.56 60.07,11.56 62.1,13.59 63.12,13.59 63.88,12.83 63.88,8.64 FTDI.2
  Bottom 0.254: U1.3 41.15,60.96 39.37,59.18 39.37,38.99 40.39,37.97 43.43,37.97 44.32,37.08 44.32,32.77 46.1,30.99 52.96,30.99 60.83,23.11 60.83,5.59 FTDI.2
ACCEL_SWITCH
  Top 0.254: 47.62,35.56 U1.13 46.86,35.56 40.01,42.42 33.02,42.42 32.38,41.78 32.38,40.39 31.88,39.88 31.88,35.56 31.24,34.92 29.59,34.92 29.08,34.42 29.08,26.67 23.37,26.67 17.4,20.7 17.4,18.8 S1.2
BARGRAPH1
  Top 0.254: U1.15 53.72,35.05 53.72,41.15 54.48,41.91 57.15,41.91 58.93,43.69 70.61,43.69 73.42,46.49 R18.1
BARGRAPH2  (via drill 0.6)
  Top 0.254: R21.1 52.2,80.77 52.96,80.01 52.96,71.12 51.18,69.34 51.18,50.93 49.78,49.53 v45.97,49.53
  Bottom 0.254: v45.97,49.53 45.97,40.26 U1.12
BLUE1
  Top 0.254: RGB1.8 73.79,84.58 BLUE.20
BLUE2
  Top 0.254: RGB1.7 73.79,83.31 BLUE.19
BLUE3
  Top 0.254: RGB1.6 73.53,82.04 BLUE.18
BLUE4
  Top 0.254: RGB1.5 BLUE.17
BLUE5
  Top 0.254: RGB1.4 74.93,79.38 BLUE.16
BLUE6
  Top 0.254: RGB1.3 76.2,76.33 74.55,77.98 72.77,77.98 BLUE.15
BLUE7
  Top 0.254: RGB1.2 76.2,73.53 74.8,75.18 74.8,76.71 72.77,76.71 BLUE.14
BLUE8
  Top 0.254: RGB1.1 76.2,70.99 74.8,72.39 74.8,74.17 73.53,75.44 72.77,75.44 BLUE.13
BLUE9  (via drill 0.6)
  Top 0.254: BLUE.12 63.37,75.44 v68.71,75.44 | RGB2.8 76.71,28.57 77.85,29.72 77.85,50.55 v76.83,51.56
  Bottom 0.254: v68.71,75.44 70.99,73.15 70.99,68.07 72.77,66.29 72.77,55.63 v76.83,51.56
BLUE10  (via drill 0.6)
  Top 0.254: BLUE.11 63.37,76.71 v70.23,76.71 | RGB2.7 76.71,26.04 78.36,27.69 78.36,51.69 v76.83,53.21
  Bottom 0.254: v70.23,76.71 71.5,75.44 71.5,68.33 73.28,66.55 73.28,56.77 v76.83,53.21
BLUE11  (via drill 0.6)
  Top 0.254: BLUE.10 63.37,77.98 v68.71,77.98 | RGB2.6 76.71,23.5 78.87,25.91 78.87,52.83 v76.83,54.86
  Bottom 0.254: v68.71,77.98 70.48,77.98 72.01,76.45 72.01,68.58 73.79,66.8 73.79,57.91 v76.83,54.86
BLUE12  (via drill 0.6)
  Top 0.254: BLUE.9 63.37,79.25 v70.23,79.25 | RGB2.5 76.45,20.95 78.36,23.11 79.38,24.13 79.38,53.98 v76.83,56.52
  Bottom 0.254: v70.23,79.25 72.52,76.96 72.52,68.83 74.3,67.06 74.3,59.05 v76.83,56.52
BLUE13  (via drill 0.6)
  Top 0.254: BLUE.8 63.37,80.52 v68.71,80.52 | v76.83,58.17 79.88,55.12 79.88,22.1 RGB2.4
  Bottom 0.254: v68.71,80.52 70.48,80.52 73.03,77.98 73.03,69.09 74.8,67.31 74.8,60.2 v76.83,58.17
BLUE14  (via drill 0.6)
  Top 0.254: BLUE.7 63.37,81.79 v70.23,81.79 | v76.83,59.94 80.39,56.39 80.39,20.07 RGB2.3
  Bottom 0.254: v70.23,81.79 73.53,78.49 73.53,69.34 75.31,67.56 75.31,61.47 v76.83,59.94
BLUE15  (via drill 0.6)
  Top 0.254: BLUE.6 63.37,83.06 v68.71,83.06 | v76.83,61.72 80.9,57.66 80.9,18.03 RGB2.2
  Bottom 0.254: v68.71,83.06 70.48,83.06 74.04,79.5 74.04,69.6 75.82,67.82 75.82,62.74 v76.83,61.72
BLUE16  (via drill 0.6)
  Top 0.254: BLUE.5 63.37,84.33 v70.23,84.33 | v76.83,63.5 78.11,62.23 78.11,61.59 81.41,58.29 81.41,16 RGB2.1
  Bottom 0.254: v70.23,84.33 74.55,80.01 74.55,69.85 76.33,68.07 76.33,64.01 v76.83,63.5
BUTTON_A
  Top 0.254: A.4 A.3
  Bottom 0.254: U1.23 59.82,53.34 60.33,52.83 62.61,52.83 63.88,51.56 63.88,47.75 73.03,38.61 73.03,26.42 74.68,24.77 R10.1 81.02,22.24 84.71,18.54 91.19,18.54 92.33,19.68 92.33,24.38 101.96,34.01 A.3
BUTTON_B
  Top 0.254: B.4 B.3
  Bottom 0.254: B.3 87.94,23.37 81.92,23.37 81.92,26.41 R11.1 74.68,27.3 73.53,28.45 73.53,38.86 64.39,48.01 64.39,53.59 62.61,55.37 60.33,55.37 59.82,55.88 U1.24
BUTTON_DOWN
  Top 0.254: DOWN.4 15.29,28.7 23.24,28.7 26.93,32.4 R7.1 26.93,39.99 26.92,40.01 31.24,40.01 31.88,40.64 31.88,42.04 32.77,42.93 40.26,42.93 43.18,40.01 47.24,40.01 U1.11
  Bottom 0.254: DOWN.4 DOWN.3
BUTTON_LEFT
  Top 0.254: U1.5 R8.1 40.01,56.78 40.01,59.69 38.48,59.69 38.23,59.44 38.23,56.13 35.43,53.34 26.04,53.34 15.11,42.42 9.27,42.42 6.45,39.6 LEFT.4
  Bottom 0.254: LEFT.4 LEFT.3
BUTTON_RESTART
  Top 0.254: RST.4 RST.3
  Bottom 0.254: U1.25 59.56,58.42 60.07,57.91 62.61,57.91 64.9,55.63 64.9,48.26 74.04,39.12 74.04,30.48 74.68,29.84 R12.1 81.02,30.85 81.66,31.5 92.58,31.5 94.61,29.46 94.61,27.69 90.55,23.62 90.55,21.06 RST.4
BUTTON_RIGHT
  Top 0.254: RIGHT.4 23.5,40.36 23.5,50.04 26.29,52.83 34.67,52.83 35.31,52.2 39.88,52.2 40.91,53.22 R9.1 U1.6
  Bottom 0.254: RIGHT.4 RIGHT.3
BUTTON_UP
  Top 0.254: U1.4 R6.1 40.77,58.56 40.77,60.2 38.23,60.2 37.72,59.69 37.72,56.39 35.18,53.85 25.78,53.85 16.59,44.65 UP.4
  Bottom 0.254: UP.4 UP.3
GND  (via drill 0.6)
  Top 0.254: 72.52,105.92 RED.21 | 67.44,111.38 67.31,111.25 | 72.52,85.6 BLUE.21 | R19.2 73.16,62.09 | C6.1 73.53,55.74 | R6.2 R8.2 R9.2 | R9.2 39.1,53.46 | 25.91,88.52 GREEN.21 | 58.69,106.36 IC3.1 58.93,105.92 | 63.12,109.73 RED.1 | R9.2 39.1,53.58 40.13,54.61 49.53,54.61 49.91,54.23 49.91,52.45 49.4,51.94 44.7,51.94 43.81,51.05 43.81,49.15 | R7.2 | C1.1 C2.1
  Top 0.406: v84.45,24.77 82.17,22.48 82.17,15.49 77.6,10.92 77.6,9.27 | 73.53,55.74 73.53,57.4 | 32.13,9.14 32.26,9.27 | 24.77,97.79 20.57,97.79 17.4,94.61 17.4,92.35 GREEN.1 | 24.77,97.79 R2.2 23.5,96.4 23.5,90.93 25.91,88.52 | 24.77,97.79 v26.29,99.31 | 58.93,106.05 59.05,106.17
  Top 0.61: 48.51,74.3 48.78,74.56 48.78,75.81 IC4.4 45.34,79.25 45.34,80.64 46.23,81.53 47.62,81.53 50.15,84.06 R22.2 52.69,84.06 58.17,89.53 BLUE.1 66.16,89.53 R3.2 | 48.51,74.3 IC4.2 | 71.5,105.92 69.08,108.34 R1.2 68.2,112.52 67.44,111.76 67.44,111.38 | 71.5,105.92 72.52,105.92 | 67.31,111.25 65.9,109.86 RED.1 59.32,109.86 C11.2 58.69,106.36 | 71.5,105.92 70.36,104.78 70.36,95.63 69.08,94.35 R3.2 | R3.2 69.08,87.51 71.12,85.6 | 71.12,85.6 72.52,85.6 | U$1.1 35.81,113.03 40.89,107.95 U$1.14 43.81,107.95 46.1,105.66 | 71.12,85.6 v69.47,85.6 | 73.16,62.09 v71.75,63.5 | C4.1 C3.1 52.69,28.45 51.44,28.45 51.18,28.19 51.18,26.92 50.93,26.67 49.65,26.67 | 46.1,105.66 47.37,106.93 MMA8452.6 48.9,106.93 52.96,102.87 57.91,102.87 58.93,103.89 58.93,105.92 58.93,106.05 | 46.1,105.66 46.1,101.22 MMA8452.3 | IC1.4 67.56,55.5 67.56,57.28 68.2,57.91 69.72,57.91 70.23,57.4 73.53,57.4 75.31,57.4 | R19.2 74.55,60.59 74.55,60.58 75.31,59.82 75.31,57.4 | U2.4 46.35,23.36 C8.2 49.65,26.67 | GREEN.1 16.38,92.33 15.49,91.44 v15.49,76.58 | C7.2 47.99,28.46 48.13,28.32 48.13,26.8 48.26,26.67 49.65,26.67 | v76.58,7.49 77.6,8.51 77.6,9.27 74.68,9.27 74.3,9.65 74.3,9.91 | 74.3,9.91 74.3,39.37 | 74.3,39.37 74.3,50.93 75.31,51.94 75.31,57.4 | SP1.2 68,9.91 74.3,9.91 | U3.2 70.64,39.37 74.3,39.37 | C12.1 48.91,73.9 48.51,74.3 | 19.3,19.56 S1.3
  Top 0.813: 32.26,22.23 32.26,25.47 36.11,29.32 IC2.3 34.56,31.52 C10.- | 32.26,22.23 32.26,9.27 | 32.13,9.14 27.18,9.14 21.97,14.35 21.97,16.89 19.3,19.56 | v25.02,38.1 25.02,39.75 R7.2 | 25.02,39.88 25.02,49.78 26.67,51.44 32.13,51.44 34.42,49.15 | U1.8 44.83,48.26 43.94,49.15 43.81,49.15 34.42,49.15 | 34.42,49.15 34.66,48.91 C1.1 | X1.2 34.56,19.01 C9.- 32.26,22.23
  Bottom 0.254: 46.86,2.16 46.99,2.16
  Bottom 0.406: v26.29,99.31 26.8,99.31 28.32,100.84 28.32,103.38 29.72,104.78 33.27,104.78 33.91,104.14 38.48,104.14 U$1.14 | R12.2 R11.2 R10.2 v84.45,24.77 | ATTINY85_ISP.6 44.07,6.22 45.85,4.45 45.85,3.17 46.86,2.16
  Bottom 0.61: v69.47,85.6 67.94,85.6 67.44,85.09 67.44,72.64 | 67.44,72.64 67.44,63.75 68.2,62.99 69.85,62.99 70.36,63.5 v71.75,63.5 | ATMEGA328P_ISP.6 54.1,4.57 54.1,3.05 | 53.72,52.07 53.72,58.93 54.48,59.69 58.67,59.69 59.44,60.45 62.61,60.45 65.66,57.4 65.66,52.32 IC1.2 69.22,49.02 70.48,50.29 70.48,52.58 IC1.4 | 54.1,3.05 53.21,2.16 46.99,2.16 36.7,2.16 | 54.1,3.05 54.74,3.05 55.75,2.03 64.64,2.03 FTDI.5 68.71,3.81 FTDI.6 72.9,7.49 v76.58,7.49 | IC4.2 67.44,72.64
  Bottom 0.813: U1.22 54.99,50.8 53.72,52.07 49.91,48.26 U1.8 | 36.7,2.16 35.43,3.43 35.43,6.48 | v15.49,76.58 15.37,47.75 v25.02,38.1 25.02,25.32 S1.3 | X1.2 45.18,16.61 U2.4
GREEN1
  Top 0.203: RGB1.21 30.48,97.41 28.17,95.2 28.17,88.09 27.86,87.78 27.36,87.78 GREEN.20
GREEN2
  Top 0.203: RGB1.22 29.57,95.89 28.57,95 28.57,87.58 28.17,87.17 28.17,86.46 27.76,86.06 26.9,86.06 GREEN.19
GREEN3
  Top 0.203: RGB1.23 29.77,93.34 28.98,92.56 28.98,87.38 28.57,86.97 28.57,86.16 28.17,85.75 28.17,85.14 27.76,84.73 26.85,84.73 GREEN.18
GREEN4
  Top 0.203: RGB1.24 30.28,90.81 29.39,89.92 29.39,87.17 28.98,86.77 28.98,85.95 28.57,85.55 28.57,84.84 28.17,84.43 28.17,83.92 27.76,83.52 26.9,83.52 GREEN.17
GREEN5
  Top 0.203: RGB1.25 30.48,87.66 29.39,86.56 29.39,85.75 28.98,85.34 28.98,84.63 28.57,84.23 28.57,83.72 28.17,83.31 28.17,82.7 27.76,82.3 26.95,82.3 GREEN.16
GREEN6
  Top 0.203: RGB1.26 29.97,85.72 29.39,85.14 29.39,84.43 28.98,84.02 28.98,83.52 28.57,83.11 28.57,82.5 28.17,82.09 28.17,81.48 27.66,80.97 26.9,80.97 GREEN.15
GREEN7
  Top 0.254: GREEN.14 27.76,79.76 RGB1.27
GREEN8
  Top 0.254: GREEN.13 27.69,78.36 RGB1.28
GREEN9  (via drill 0.6)
  Top 0.254: GREEN.12 17.55,78.23 v24.77,78.23
  Bottom 0.254: RGB2.21 31.88,40.13 31.88,70.99 31.11,71.75 29.72,71.75 27.3,74.17 27.3,76.58 25.65,78.23 v24.77,78.23
GREEN10  (via drill 0.6)
  Top 0.254: GREEN.11 17.55,79.5 v23.88,79.5
  Bottom 0.254: RGB2.22 32.38,38.1 32.38,73.66 31.75,74.3 28.96,74.3 27.94,75.31 27.94,76.83 25.27,79.5 v23.88,79.5
GREEN11  (via drill 0.6)
  Top 0.254: GREEN.10 17.55,80.77 v22.86,80.77
  Bottom 0.254: RGB2.23 32.89,36.07 32.89,75.69 31.75,76.83 28.7,76.83 24.77,80.77 v22.86,80.77
GREEN12  (via drill 0.6)
  Top 0.254: GREEN.9 17.55,82.04 v21.97,82.04
  Bottom 0.254: RGB2.24 33.4,34.04 33.4,77.72 31.75,79.38 26.92,79.38 24.26,82.04 v21.97,82.04
GREEN13  (via drill 0.6)
  Top 0.254: GREEN.8 17.55,83.31 v22.73,83.31
  Bottom 0.254: v22.73,83.31 24.77,83.31 26.16,81.92 31.75,81.92 33.91,79.76 33.91,32 RGB2.25
GREEN14  (via drill 0.6)
  Top 0.254: GREEN.7 17.55,84.58 v23.37,84.58
  Bottom 0.254: v23.37,84.58 22.99,84.45 31.75,84.45 34.42,81.79 34.42,29.97 RGB2.26
GREEN15  (via drill 0.6)
  Top 0.254: GREEN.6 17.55,85.85 v24.13,85.85
  Bottom 0.254: RGB2.27 34.92,27.94 34.92,83.82 31.75,87 29.21,87 28.07,85.85 v24.13,85.85
GREEN16  (via drill 0.6)
  Top 0.254: GREEN.5 17.55,87.12 v24.77,87.12
  Bottom 0.254: RGB2.28 35.43,25.91 35.43,85.85 31.75,89.53 28.19,89.53 25.78,87.12 v24.77,87.12
I2C_CLOCK  (via drill 0.6)
  Top 0.254: v56.26,78.49 56.26,66.55 U1.28
  Bottom 0.254: MMA8452.5 50.42,104.39 56.26,98.55 v56.26,78.49
I2C_DATA  (via drill 0.6)
  Top 0.254: v53.98,81.79 53.98,68.07 53.21,67.31 53.21,64.26 53.98,63.5 U1.27
  Bottom 0.254: MMA8452.4 50.42,101.85 53.98,98.3 v53.98,81.79
LATCH  (via drill 0.6)
  Top 0.254: RED.4 63.37,105.92 v66.42,105.92 | v66.42,88.14 66.67,87.88 66.67,86.36 66.04,85.72 BLUE.4 63.12,85.6 61.34,85.6 58.8,83.06 58.8,61.21 57.28,59.69 54.23,59.69 53.72,59.18 53.72,43.43 53.21,42.93 53.21,38.1 U1.14 | GREEN.4 18.16,88.52 v19.43,89.79
  Bottom 0.254: v66.42,88.14 v66.42,105.92 68.2,107.7 68.2,109.73 63.63,114.3 41.27,114.3 40.26,113.28 40.26,111 U$1.4 34.16,105.41 32.26,107.31 27.69,107.31 26.04,105.66 26.04,104.9 19.05,97.92 19.05,95.38 20.07,94.36 20.07,90.42 v19.43,89.79
MISO  (via drill 0.6)
  Top 0.406: U1.18 57.78,40.64 67.69,30.73 67.69,21.46 65.53,19.3 58.67,19.3 v56.52,17.14
  Bottom 0.254: ATMEGA328P_ISP.1 46.1,4.95 46.1,6.99 46.86,7.75 48.64,7.75 49.78,8.89 55.12,8.89 56.52,10.29 v56.52,17.14
MOSI  (via drill 0.6)
  Top 0.254: U$1.3 37.21,105.41 v37.21,95.5 | U1.17 56.26,38.1 58.04,36.32 58.04,32.77 56.77,31.5 46.99,31.5 42.67,35.81 v42.67,36.32
  Bottom 0.254: v37.21,95.5 37.21,92.96 35.94,91.69 35.94,36.58 37.47,35.05 40.51,35.05 40.96,34.61 | ATMEGA328P_ISP.4 49.91,6.86 51.31,8.26 55.88,8.26 59.82,12.19 59.82,22.61 52.45,29.97 45.59,29.97 40.96,34.61 | v42.67,36.32 40.96,34.61
MOTOR  (via drill 0.6)
  Top 0.254: U1.26 54.74,60.96 53.21,59.44 53.21,43.69 v51.56,42.04
  Top 0.406: v59.05,41.91 R29.1
  Bottom 0.254: v51.56,42.04 51.69,41.91 v59.05,41.91
N$1
  Top 0.254: R1.1 70.88,109.59 71.75,108.71 72.52,108.71 RED.23
N$2  (via drill 0.6)
  Top 0.254: v26.8,104.39 26.92,104.52 27.81,105.16 29.08,105.16 RGB1.18 33.15,103.38 33.15,101.09 33.91,100.33 U$1.6
  Bottom 0.254: RGB2.18 28.32,48.51 28.32,71.63 26.29,73.66 26.29,74.68 20.19,80.77 20.19,84.71 23.5,88.01 23.5,99.69 24.51,100.71 25.4,100.71 26.8,102.11 v26.8,104.39
N$3  (via drill 0.6)
  Top 0.254: v25.78,103.38 25.91,103.5 RGB1.19 32.64,101.35 32.64,98.55 33.4,97.79 U$1.7
  Bottom 0.254: RGB2.19 27.81,46.48 27.81,71.37 25.78,73.41 25.78,74.42 19.68,80.52 19.68,84.96 22.99,88.27 22.99,99.95 24.26,101.22 25.15,101.22 25.78,101.85 v25.78,103.38
N$4  (via drill 0.6)
  Top 0.254: v24.64,102.23 28.96,102.23 RGB1.20 32.13,99.31 32.13,96.52 33.4,95.25 U$1.8
  Bottom 0.254: v24.64,102.23 22.48,100.33 22.48,88.52 19.18,85.22 19.18,80.26 25.27,74.17 25.27,73.15 27.3,71.12 27.3,44.45 RGB2.20
N$5  (via drill 0.6)
  Top 0.254: U$1.9 42.29,94.49 41.78,93.98 32.77,93.98 32.13,93.34 32.13,79.5 30.73,78.11 RGB1.29 27.69,75.31 27.69,72.26 v24.51,69.09
  Bottom 0.254: v24.51,69.09 26.8,66.8 26.8,43.94 29.08,41.66 29.08,20.07 29.21,19.94 RGB2.29
N$6  (via drill 0.6)
  Top 0.254: U$1.10 43.56,96.52 43.56,93.98 43.05,93.47 33.15,93.47 32.64,92.96 32.64,77.72 RGB1.30 28.32,73.41 28.32,71.37 v24.51,67.56
  Bottom 0.254: v24.51,67.56 26.29,65.79 26.29,43.43 28.57,41.15 28.57,17.78 30.23,15.88 RGB2.30
N$7  (via drill 0.6)
  Top 0.254: U$1.11 44.07,98.55 44.07,93.6 43.43,92.96 33.53,92.96 33.15,92.58 33.15,75.69 RGB1.31 28.96,71.5 28.96,70.1 24.89,66.04 v24.51,66.04
  Bottom 0.254: v24.51,66.04 25.78,64.77 25.78,43.18 28.07,40.89 28.07,15.75 RGB2.31
N$8  (via drill 0.6)
  Top 0.254: U$1.12 44.58,100.58 44.58,93.22 43.81,92.46 33.91,92.46 33.66,92.2 33.66,73.66 RGB1.32 v24.51,64.52
  Bottom 0.254: v24.51,64.52 25.27,63.75 25.27,42.93 27.56,40.64 27.56,13.72 RGB2.32
N$9
  Top 0.254: C5.2 56.26,5.83 FTDI.1
N$10
  Top 0.254: R17.2 85.36,64.77 DZ1.15
N$11
  Top 0.254: C1.2 Y1.2 44.7,45.72 U1.9
N$12
  Top 0.254: C2.2 41.02,44.32 Y1.1 44.2,43.18 U1.10
N$13
  Top 0.254: C3.2 52.7,25.91 Y2.2 49.15,18.03 U2.3
N$14
  Top 0.406: C4.2 54.23,25.14 Y2.1 51.44,19.56 U2.2
N$15
  Top 0.254: R16.2 85.36,67.31 DZ1.14
N$16
  Top 0.254: R15.2 85.36,69.85 DZ1.13
N$17  (via drill 0.6)
  Top 0.254: v66.93,108.71 66.8,108.58 RED.2 | v25.02,96.01 24.26,95.25 24.26,91.69 26.04,89.92 26.7,89.92 GREEN.22
  Bottom 0.254: v25.02,96.01 25.02,96.52 29.08,100.58 29.08,101.85 29.46,102.23 33.27,102.23 33.91,101.6 43.31,101.6 45.34,103.63 45.34,111.76 47.12,113.54 63.5,113.54 66.93,110.11 v66.93,108.71
N$18
  Top 0.254: R2.1 26.54,97.54 26.54,96.14 24.77,94.36 24.77,92.2 25.78,91.19 26.7,91.19 GREEN.23
N$19  (via drill 0.6)
  Top 0.254: v27.81,106.17 27.94,106.3 RGB1.17 30.48,108.33 32.64,106.17 32.64,104.9 U$1.5
  Bottom 0.254: RGB2.17 28.83,50.55 28.83,71.88 26.8,73.91 26.8,74.93 20.7,81.03 20.7,84.45 24,87.76 24,99.44 24.77,100.2 25.65,100.2 27.3,101.85 27.3,103.38 27.81,103.89 v27.81,106.17
N$20
  Top 0.254: R14.2 85.36,72.39 DZ1.12
N$21
  Top 0.254: R13.2 85.36,74.93 DZ1.11
N$22  (via drill 0.6)
  Top 0.254: v70.48,88.01 71.37,87 BLUE.22 | v40.77,63.63 37.21,60.07 37.21,56.64 34.92,54.36 24.51,54.36 v23.5,53.34 | GREEN.2 18.54,91.06 18.92,91.44 18.92,92.71 18.03,93.6 18.03,94.36 20.45,96.77 v21.59,96.77
  Bottom 0.254: v70.48,88.01 69.98,88.01 68.96,86.87 67.82,86.87 57.28,76.33 44.96,76.33 44.32,75.69 44.32,69.72 40.77,66.17 v40.77,63.63 | v23.5,53.34 23.5,75.18 18.67,80.01 18.67,85.47 21.97,88.77 21.97,96.39 v21.59,96.77
N$23
  Top 0.254: IC1.10 62.1,67.56 62.1,68.58 66.17,72.64 71.75,72.64 74.8,69.6 74.8,69.22 74.93,69.09 77.71,69.09 R13.1
N$24
  Top 0.254: R3.1 70.99,91.58 70.99,89.15 71.88,88.27 BLUE.23
N$25
  Top 0.254: IC1.11 62.61,65.53 62.61,68.33 66.42,72.14 71.5,72.14 74.3,69.34 74.3,68.71 74.42,68.58 79.75,68.58 R14.1
N$26
  Top 0.254: IC1.12 63.12,63.5 63.12,68.07 66.67,71.63 71.25,71.63 73.79,69.09 73.79,68.2 73.91,68.07 81.78,68.07 R15.1
N$27
  Top 0.254: IC1.13 62.61,60.45 62.61,62.23 63.63,63.25 63.63,67.82 66.93,71.12 70.99,71.12 73.28,68.83 73.28,67.69 73.41,67.56 80.25,67.56 R16.1
N$28
  Top 0.254: IC1.14 62.61,57.91 62.61,59.69 63.12,60.2 63.12,61.98 64.14,62.99 64.14,67.56 67.18,70.61 70.74,70.61 72.77,68.58 72.77,67.18 72.9,67.06 80.01,67.06 81.15,65.91 81.15,64.14 R17.1
N$29
  Top 0.254: IC1.15 62.61,55.37 62.61,57.15 63.12,57.66 63.12,59.44 63.63,59.94 63.63,61.72 64.64,62.74 64.64,67.31 67.44,70.1 70.48,70.1 72.26,68.33 72.26,66.67 72.39,66.55 79.76,66.55 80.64,65.66 80.64,62.87 81.79,61.72 86.61,61.72 87,62.1 DZ1.16
N$30
  Top 0.254: IC1.16 63.25,53.47 63.25,57.02 63.63,57.4 63.63,59.18 64.14,59.69 64.14,61.47 65.15,62.48 65.15,67.06 67.69,69.6 70.23,69.6 71.75,68.07 71.75,66.17 71.88,66.04 79.5,66.04 80.14,65.41 80.14,62.61 81.66,61.09 86.36,61.09 87,60.45 DZ1.17
N$31
  Top 0.254: IC1.17 63.75,51.44 63.75,56.77 64.14,57.15 64.14,58.93 64.64,59.44 64.64,61.21 65.66,62.23 65.66,66.8 67.94,69.09 69.98,69.09 71.25,67.82 71.25,65.66 71.37,65.53 79.25,65.53 79.63,65.15 79.63,62.36 81.53,60.45 85.6,60.45 85.85,60.2 85.85,58.29 DZ1.18
N$32
  Top 0.254: IC1.18 64.26,49.4 64.26,56.52 64.64,56.9 64.64,58.67 65.15,59.18 65.15,60.96 66.17,61.98 66.17,66.55 68.2,68.58 69.72,68.58 70.74,67.56 70.74,65.15 70.87,65.02 78.87,65.02 79.12,64.77 79.12,62.1 81.53,59.69 85.09,59.69 85.34,59.44 85.34,56.26 DZ1.19
N$33
  Top 0.254: IC1.1 65.66,49.78 65.66,60.71 66.67,61.72 66.67,66.29 68.45,68.07 69.47,68.07 70.23,67.31 70.23,64.9 70.61,64.52 78.36,64.52 78.61,64.26 78.61,61.85 81.41,59.05 84.84,59.05 84.84,54.23 DZ1.20
N$34
  Top 0.254: IC1.5 70.6,56.64 C6.2 R18.2
N$35
  Top 0.254: R20.1 71.62,60.47 R19.1 71.5,61.72 IC1.8
N$36
  Top 0.254: IC1.7 IC1.6 69.08,59.3 R20.2
N$37
  Top 0.254: IC4.11 34.67,83.31 34.67,67.56 31.62,64.52 R25.1
N$38
  Top 0.254: IC4.12 35.18,81.28 35.18,67.31 33.15,65.28 33.15,64.14 31.37,62.36 R26.1
N$39
  Top 0.254: IC4.13 35.69,79.25 35.69,67.06 33.66,65.02 33.66,62.36 31.5,60.2 R27.1
N$40
  Top 0.254: IC4.14 36.2,77.22 36.2,66.8 34.16,64.77 34.16,60.71 31.5,58.04 R28.1
N$41
  Top 0.254: DZ2.16 17.14,62.23 18.41,63.5 20.95,63.5 20.95,61.85 25.91,56.9 32.89,56.9 34.67,58.67 34.67,64.52 36.7,66.55 36.7,75.18 IC4.15
N$42
  Top 0.254: DZ2.17 17.14,59.69 18.41,60.96 20.95,60.96 25.53,56.39 33.27,56.39 35.18,58.29 35.18,64.26 37.21,66.29 37.21,73.15 IC4.16
N$43
  Top 0.254: DZ2.18 17.14,57.15 18.41,58.42 20.95,58.42 23.5,55.88 33.78,55.88 35.69,57.78 35.69,64.01 37.72,66.04 37.72,71.12 IC4.17
N$44
  Top 0.254: DZ2.19 17.14,54.61 18.41,55.88 20.95,55.88 21.46,55.37 34.16,55.37 36.2,57.4 36.2,63.75 39.24,66.8 IC4.18
N$45
  Top 0.254: DZ2.20 16.89,52.07 18.16,53.34 20.95,53.34 22.48,54.86 34.42,54.86 36.7,57.15 36.7,63.5 37.85,64.64 44.2,64.64 46.86,67.31 IC4.1
N$46
  Top 0.254: IC4.5 47.12,80.26 48.4,78.98 R21.2 C12.2
N$47
  Top 0.254: IC4.8 50.18,87.88 | 50.18,87.88 R23.1 | 50.18,87.88 50.18,87.12 R22.1
N$48
  Top 0.254: IC4.6 IC4.7 46.86,86.11 45.34,87.63 45.34,88.39 46.1,89.15 48.02,89.15 49.81,90.94 R23.2
N$49
  Top 0.254: IC4.10 34.16,85.34 34.16,67.82 33.15,66.8 R24.1
N$50
  Top 0.254: DZ2.15 17.14,64.77 18.41,66.04 20.95,66.04 21.46,65.53 21.46,62.23 25.65,58.04 R28.2
N$51
  Top 0.254: DZ2.14 17.14,67.31 18.41,68.58 20.95,68.58 21.97,67.56 21.97,62.48 24.26,60.2 R27.2
N$52
  Top 0.254: DZ2.13 17.14,69.85 18.41,71.12 20.95,71.12 22.48,69.6 22.48,63.37 23.5,62.36 R26.2
N$53
  Top 0.254: DZ2.12 17.14,72.39 18.41,73.66 20.95,73.66 22.99,71.63 22.99,63.63 23.75,62.87 27.29,62.87 R25.2
N$54
  Top 0.254: DZ2.11 17.14,74.93 18.54,76.33 20.95,76.33 23.5,73.79 23.5,63.88 24,63.37 25.52,63.37 R24.2
N$55
  Top 0.406: R29.2 62.93,41.96 U3.1
N$56
  Top 0.254: 70.23,23.3 D1.A
  Top 0.406: U3.3 69.09,41.02 68.33,40.26 68.33,33.4 70.23,31.5 JP2.P$1
  Top 0.813: JP2.P$1 70.23,23.3
N$58
  Top 0.406: SP1.1 67.82,12.95 65.79,10.92 65.79,9.14 67.44,7.49 73.91,7.49 SW2.3
POWER
  Bottom 0.813: SW1.2 29.08,3.83 X1.1
RED1
  Top 0.254: RED.20 72.77,104.9 73.79,104.9 RGB1.16
RED2
  Top 0.254: RED.19 72.64,103.63 73.79,103.63 RGB1.15
RED3
  Top 0.254: RED.18 74.93,102.23 RGB1.14
RED4
  Top 0.254: RED.17 RGB1.13
RED5
  Top 0.254: RED.16 74.93,99.69 RGB1.12
RED6
  Top 0.254: RED.15 72.77,98.3 74.04,98.3 76.2,96.14 RGB1.11
RED7
  Top 0.254: RED.14 72.77,97.03 73.79,97.03 74.55,96.27 74.55,95 RGB1.10
RED8
  Top 0.254: RED.13 73.91,95.89 74.04,95.76 74.04,92.96 RGB1.9
RED9  (via drill 0.6)
  Top 0.254: RED.12 63.37,95.76 v68.71,95.76
  Bottom 0.254: v68.71,95.76 70.48,95.76 74.8,91.44 74.8,90.17 75.44,89.53 76.96,89.53 77.85,88.65 77.85,50.55 RGB2.16
RED10  (via drill 0.6)
  Top 0.254: RED.11 63.25,97.03 v67.94,97.03
  Bottom 0.254: v67.94,97.03 70.23,97.03 75.18,92.08 77.47,92.08 78.36,91.19 78.36,48.51 RGB2.15
RED11  (via drill 0.6)
  Top 0.254: RED.10 63.37,98.3 v68.71,98.3
  Bottom 0.254: v68.71,98.3 71.5,98.3 75.18,94.61 77.47,94.61 78.87,93.22 78.87,46.48 RGB2.14
RED12  (via drill 0.6)
  Top 0.254: RED.9 63.25,99.57 v67.94,99.57
  Bottom 0.254: v67.94,99.57 72.52,99.57 74.93,97.16 77.47,97.16 79.38,95.25 79.38,44.45 RGB2.13
RED13  (via drill 0.6)
  Top 0.254: RED.8 63.37,100.84 v68.71,100.84
  Bottom 0.254: v68.71,100.84 73.79,100.84 74.93,99.69 77.47,99.69 79.88,97.28 79.88,42.42 RGB2.12
RED14  (via drill 0.6)
  Top 0.254: RED.7 63.25,102.11 v67.94,102.11
  Bottom 0.254: RGB2.11 80.39,40.39 80.39,99.31 77.47,102.23 68.07,102.23 v67.94,102.11
RED15  (via drill 0.6)
  Top 0.254: RED.6 63.37,103.38 v68.96,103.38
  Bottom 0.254: v68.96,103.38 70.48,103.38 71.88,104.78 77.47,104.78 80.9,101.35 80.9,38.35 RGB2.10
RED16  (via drill 0.6)
  Top 0.254: RED.5 63.37,104.65 v67.94,104.65
  Bottom 0.254: v67.94,104.65 70.48,104.65 73.15,107.31 77.47,107.31 81.53,103.25 81.53,101.35 81.41,36.32 RGB2.9
RESET
  Top 0.254: U1.1 45.84,63.74 R4.2 | C5.1 52.45,3.82 ATMEGA328P_ISP.5
  Bottom 0.254: U1.1 45.47,66.04 38.86,59.44 38.86,38.73 40.13,37.47 43.18,37.47 43.81,36.83 43.81,32.51 45.85,30.48 52.7,30.48 60.33,22.86 60.33,9.78 58.17,7.62 51.82,7.62 51.18,6.99 51.18,4.95 ATMEGA328P_ISP.5
SCK  (via drill 0.6)
  Top 0.254: RED.3 63.37,107.19 v65.66,107.19 68.71,107.19 v69.47,106.17 | v65.41,86.87 63.88,86.87 63.75,87 BLUE.3 63.12,86.87 61.34,86.87 57.78,83.31 57.78,62.99 57.02,62.23 53.72,62.23 51.69,60.2 v51.69,44.45 | ATMEGA328P_ISP.3 51.18,4.95 51.18,6.99 51.94,7.75 54.1,7.75 57.4,11.05 61.59,11.05 v62.61,12.06 | GREEN.3 18.03,89.79 19.43,91.19 19.43,93.47 v19.05,93.98
  Bottom 0.254: v19.05,93.98 18.54,94.49 18.54,98.42 25.53,105.41 25.53,105.92 29.59,109.98 33.66,109.98 U$1.2 35.94,110.49 40.26,114.81 63.88,114.81 69.47,109.22 v69.47,106.17 | v65.66,107.19 65.15,106.43 65.15,87.38 v65.41,86.87 | v51.69,44.45 52.96,43.18 U1.19 59.56,43.18 62.61,40.13 v62.61,12.06
SPI_DATA  (via drill 0.6)
  Top 0.254: U$1.16 42.55,113.28 43.31,113.28 44.96,114.94 55.24,114.94 v57.53,112.65 | v59.18,88.27 BLUE.2
  Bottom 0.254: v57.53,112.65 57.53,89.92 v59.18,88.27